# EAGLE design BontempoV2. (EAGLE 9.6.2)
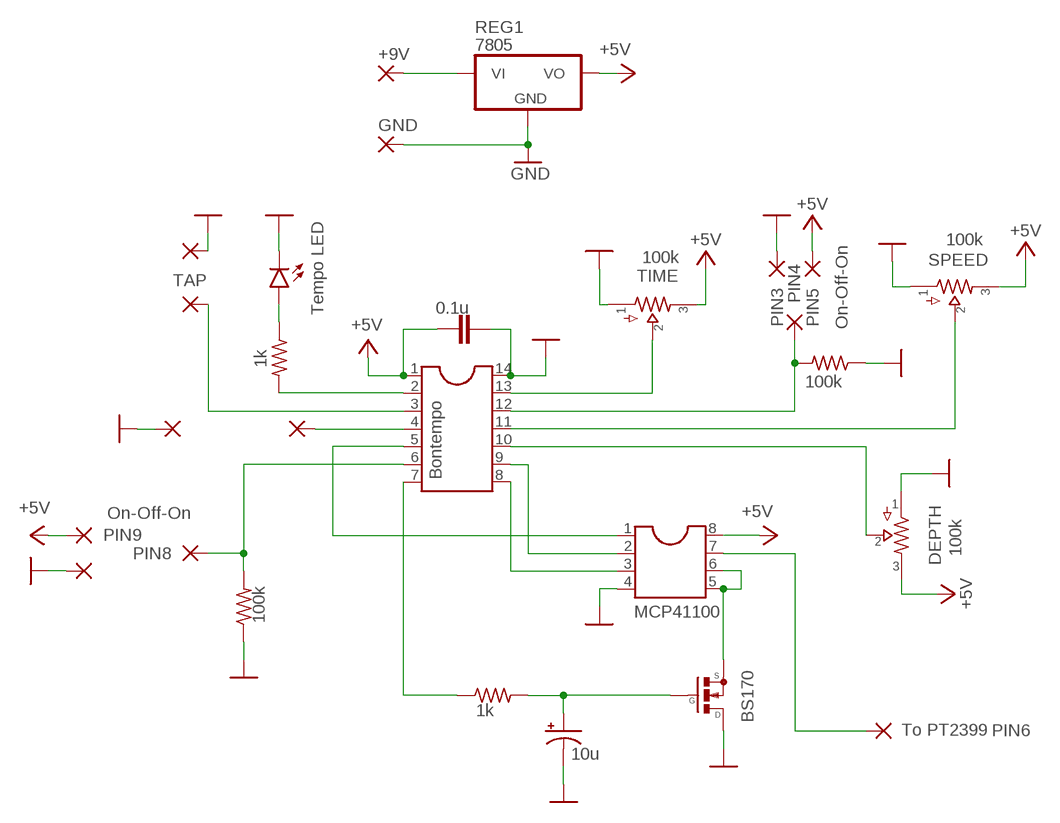
[diagram p0: schematic, sheet 1]

## Parts
+9V  2,54/1,1  [2,54/1,1]
C1  10u  0500  [050_020]
C2  0.1u  CER/FILMBOX.1  [BOX_SMALL]
D1  LED3MM  [LED3MM]
DEPTH  100k  POTSSMALL_PADS  [PADS_SMALL]
GND  2,54/1,1  [2,54/1,1]
IC1  Bontempo  DIL14  [DIL14]
IC2  MCP41100  DIL8  [DIL08]
PIN1  2,54/1,1  [2,54/1,1]
PIN2  2,54/1,1  [2,54/1,1]
PIN3  2,54/1,1  [2,54/1,1]
PIN4  2,54/1,1  [2,54/1,1]
PIN5  2,54/1,1  [2,54/1,1]
PIN6  2,54/1,1  [2,54/1,1]
PIN7  2,54/1,1  [2,54/1,1]
PIN8  2,54/1,1  [2,54/1,1]
PIN9  2,54/1,1  [2,54/1,1]
PIN11  2,54/1,1  [2,54/1,1]
PIN12  2,54/1,1  [2,54/1,1]
Q1  BS170  [SOT54ES]
R1  1k  R_.3B  [R0207/3]
R3  1k  R_.3B  [R0207/3]
R4  100k  R_.3B  [R0207/3]
R5  100k  R_.3B  [R0207/3]
REG1  7805  [TO92-]
SPEED  100k  POTSSMALL_PADS  [PADS_SMALL]
TIME  100k  POTSSMALL_PADS  [PADS_SMALL]

## Nets
+5V: C2.1 DEPTH.3 IC1.1 IC2.8 PIN5.1(P) PIN9.1(P) REG1.3(VO) SPEED.3 TIME.3
GND: C1.- C2.2 D1.K(C) DEPTH.1 GND.1(P) IC1.14 IC2.4 PIN2.1(P) PIN3.1(P) PIN7.1(P) PIN11.1(P) Q1.D R4.1 R5.1 REG1.2(GND) SPEED.1 TIME.1
N$1: IC1.2 R1.2
N$2: IC2.5 IC2.6 Q1.S
N$3: IC1.9 IC2.2
N$4: IC1.8 IC2.3
N$5: D1.A R1.1
N$6: IC1.4 PIN12.1(P)
N$7: IC1.3 PIN1.1(P)
N$8: C1.+ Q1.G R3.2
N$9: IC1.7 R3.1
N$10: IC1.5 IC2.1
N$12: IC1.6 PIN8.1(P) R4.2
N$13: IC1.13 TIME.2
N$14: IC1.11 SPEED.2
N$15: IC1.12 PIN4.1(P) R5.2
N$16: DEPTH.2 IC1.10
N$17: +9V.1(P) REG1.1(VI)
N$18: IC2.7 PIN6.1(P)

## Notes on the sheet
- TAP
- Tempo LED
- On-Off-On
- On-Off-On
- To PT2399

## Library data of the parts
+9V GND PIN1-PIN9 PIN11 PIN12 = wirepad:2,54/1,1: THROUGH-HOLE PAD
C1 = capacitors-elec:050: 0.22 - 100uF Xicon values at Mouser.com: 10V: 10 - 100uF; 16V: 2.2 - 47uF; 25V: 0.47 - 47uF; 50V: 0.22 - 22uF
C2 = capacitors-film:CER/FILM: 47 - 120pF Xicon Ceramic Disc 2.5mm lead spacing
D1 = diodes:LED
DEPTH SPEED TIME = potentiometers:POTS
IC1 = integrated circuits:DIL14
IC2 = integrated circuits:DIL8: Dual In Line
Q1 = transistors:BS170: N-CHANNEL MOS FET
R1 R3-R5 = resistors:R_
REG1 = regulators:7805

## Board
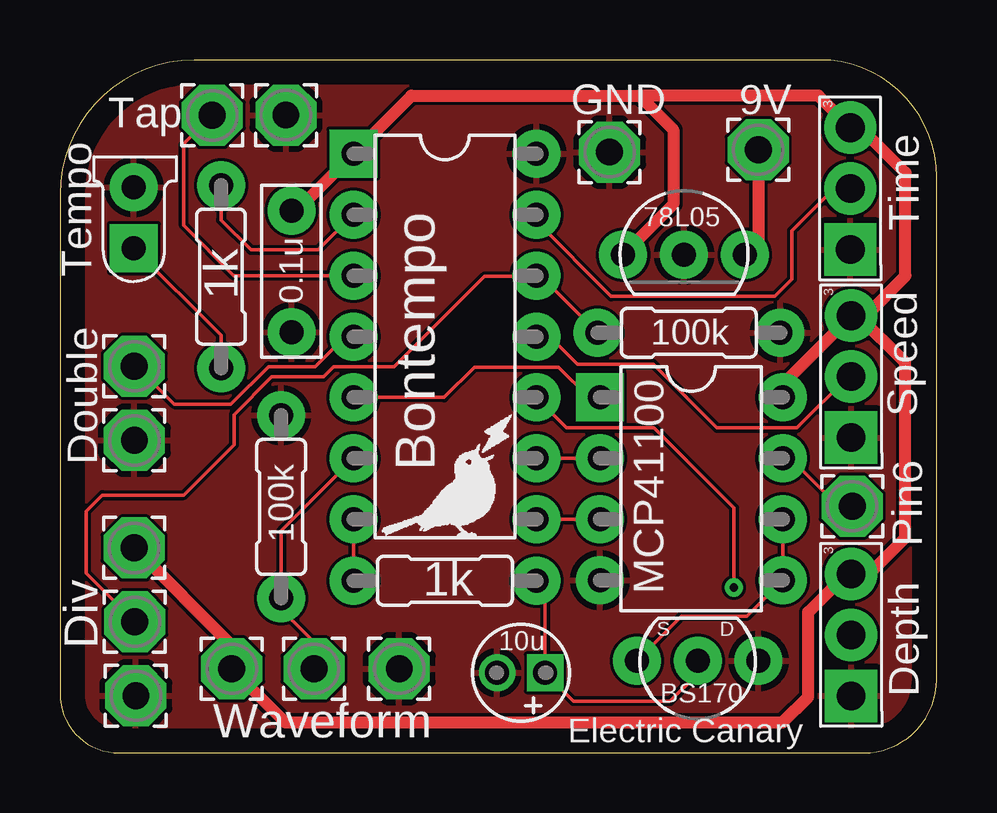
[diagram p1: board, top side]
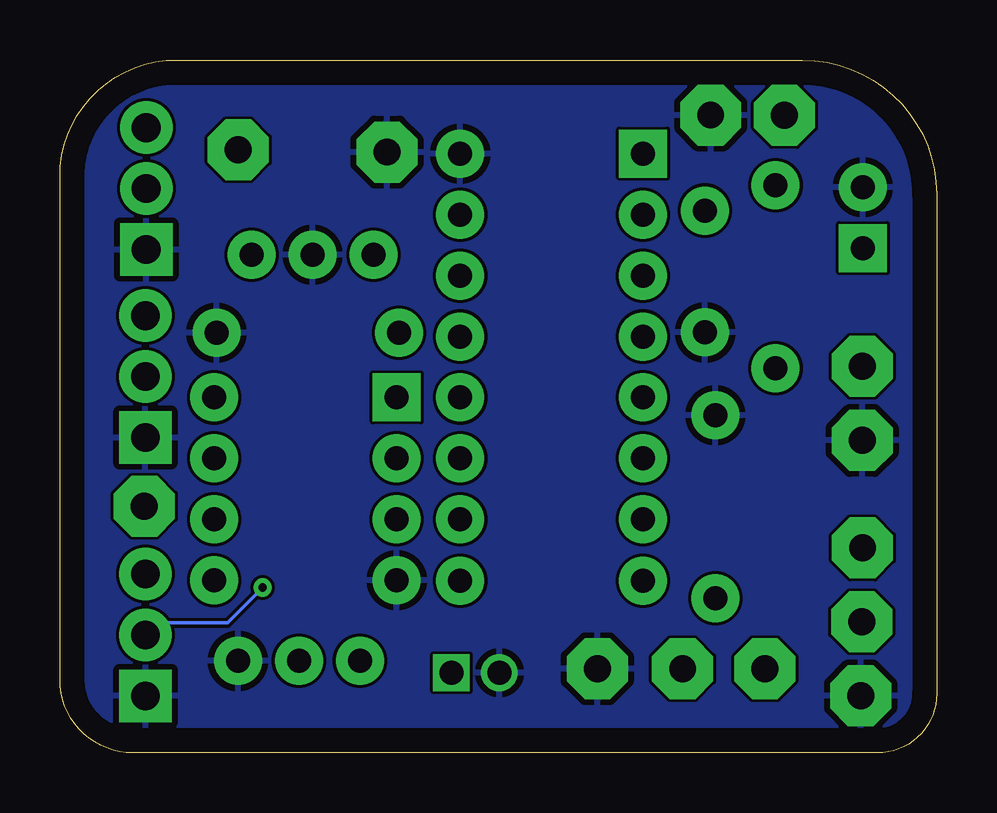
[diagram p2: board, bottom side, seen from below]

Size 36.54 x 28.87 mm. Coordinates in mm from the lower left corner, seen from the top.
Outline: 0,23.28 0,2.46 arc90 2.46,0 33.5,0 arc90 36.54,3.05 36.54,24 arc90 31.68,28.87 5.59,28.87 arc90 0,23.28
Copper layers (1*16): Top 0.035mm / dielectric 1.5mm / Bottom 0.035mm
Design rules "default *": minimum track width 5mil, minimum drill 0.35mm, track to track 5mil, track to pad 6mil, pad to pad 6mil, via to via 6mil, smd to smd 6mil, copper to edge 40mil, drill to drill 21mil, minimum pad ring 10mil, minimum via ring 8mil, stop-mask expansion 4mil, vias tented up to drill 0mil, thermal gap 10mil

### Footprints (pad centres in the part's own frame; a part is rotated, then mirrored left to right if it is on the bottom)
2,54/1,1 = drill 1.118 pad 2.54 octagon: 1 0,0
050_020 = drill 1 pad 1.524 square: + -1,0 | drill 1 pad 1.524: - 1,0
BOX_SMALL = drill 1 pad 2: 1 -2.54,0; 2 2.54,0
LED3MM = drill 1 pad 2 square: A -1.27,0 | drill 1 pad 2: K 1.27,0
PADS_SMALL = drill 1.2 pad 2.184 square: 1 2.54,0 | drill 1.2 pad 2.184: 2 0,0; 3 -2.54,0
DIL14 = drill 1 pad 2 square: 1 -7.62,-3.81 | drill 1 pad 2: 2 -5.08,-3.81; 3 -2.54,-3.81; 4 0,-3.81; 5 2.54,-3.81; 6 5.08,-3.81; 7 7.62,-3.81; 8 7.62,3.81; 9 5.08,3.81; 10 2.54,3.81; 11 0,3.81; 12 -2.54,3.81; 13 -5.08,3.81; 14 -7.62,3.81
DIL08 = drill 1 pad 2 square: 1 -3.81,-3.81 | drill 1 pad 2: 2 -1.27,-3.81; 3 1.27,-3.81; 4 3.81,-3.81; 5 3.81,3.81; 6 1.27,3.81; 7 -1.27,3.81; 8 -3.81,3.81
SOT54ES = drill 1 pad 2: D -2.54,0; G 0,0; S 2.54,0
R0207/3 = drill 1 pad 2: 1 -3.81,0; 2 3.81,0
TO92- = drill 1 pad 2: 1 -2.54,0; 2 0,0; 3 2.54,0

### Placement (x,y rotation side)
+9V  29.11,25.13 0 top
C1  19.22,3.34 180 top
C2  9.65,20.06 270 top
D1  3.07,22.3 90 top
DEPTH  32.98,4.91 270 top
GND  22.91,25.03 0 top
IC1  16.05,17.35 270 top
IC2  26.32,11 270 top
PIN1  6.35,26.57 90 top
PIN2  9.42,26.58 90 top
PIN3  3.17,2.38 0 top
PIN4  3.12,5.46 0 top
PIN5  3.09,8.54 0 top
PIN6  33.03,10.28 0 top
PIN7  14.14,3.51 0 top
PIN8  10.59,3.51 0 top
PIN9  7.16,3.51 0 top
PIN11  3.1,13.02 0 top
PIN12  3.1,16.11 0 top
Q1  26.58,3.83 180 top
R1  6.71,19.84 90 top
R3  16.05,7.17 0 top
R4  9.22,10.25 270 top
R5  26.21,17.51 180 top
REG1  26.02,20.76 180 top
SPEED  32.98,15.68 270 top
TIME  32.95,23.51 270 top

### Tracks (layer width: path | path; a pad name or v marks a point on that pad's centre or on a via)
+5V
  Top 0.508: PIN5.1 7.16,4.47 PIN9.1 9.39,1.27 30.12,1.27 31.19,2.34 31.19,5.87 32.77,7.45 DEPTH.3 33.73,7.45 35.23,8.96 35.23,16.26 33.27,18.22 SPEED.3 | C2.1 9.87,22.6 IC1.1 14.65,27.38 24.15,27.38 | SPEED.3 30.13,15.36 IC2.8 | SPEED.3 33.59,18.22 35.25,19.88 35.25,24.18 33.37,26.05 TIME.3 31.62,27.38 24.15,27.38 | 24.15,27.38 25.57,25.96 25.57,22.85 REG1.3
GND
  pour Bottom: -1.69,36.98 -1.69,-0.81 40.43,-0.81 40.43,33.99 37.44,36.98
  pour Top: 1.75,33 -6.33,24.93 -6.33,-3.41 -4.87,-4.87 39.76,-4.87 42.96,-1.67 42.96,23.54 33.5,33 1.78,33
N$1
  Top 0.152: R1.2 6.71,22.2 7.96,20.95 10.77,20.95 IC1.2
N$2
  Top 0.152: IC2.6 IC2.5 28.63,5.7 25.91,5.7 Q1.S
N$3
  Top 0.152: IC1.9 IC2.2
N$4
  Top 0.152: IC1.8 IC2.3
N$5
  Top 0.152: R1.1 6.71,17.4 D1.A
N$6
  Top 0.152: PIN12.1 3.18,16.11 4.76,14.53 7.12,14.53 8.69,16.1 10.63,16.1 11.88,17.35 IC1.4
N$7
  Top 0.152: IC1.3 7.25,19.89 5.16,21.98 5.16,25.38 PIN1.1
N$8
  Top 0.152: R3.2 20.22,6.81 C1.+ 21.4,2.16 25.44,2.16 26.58,3.31 Q1.G
N$9
  Top 0.152: R3.1 IC1.7
N$10
  Top 0.152: IC2.1 22.04,14.81 20.78,16.07 17.28,16.07 16.01,14.81 IC1.5
N$12
  Top 0.152: IC1.6 9.22,9.25 R4.2 9.22,5.98 10.59,4.62 PIN8.1
N$13
  Top 0.152: TIME.2 32.27,23.51 30.51,21.76 30.51,19.74 29.8,19.02 22.98,19.02 19.86,22.14 IC1.13
N$14
  Top 0.152: IC1.11 20.43,17.35 21.58,16.2 24.73,16.2 27.39,13.54 30.72,13.54 32.86,15.68 SPEED.2
N$15
  Top 0.152: IC1.12 19.94,19.89 19.97,19.86 | R5.2 20.05,19.86 19.97,19.86 | PIN4.1 1.09,7.49 1.09,10.06 1.77,10.74 5.16,10.74 7.26,12.84 7.26,14.1 8.82,15.66 10.98,15.66 11.41,16.08 13.93,16.08 17.7,19.86 19.97,19.86
N$16  (via drill 0.35)
  Top 0.152: IC1.10 21.12,13.54 24.76,13.54 28.1,10.21 v28.1,6.89
  Bottom 0.152: v28.1,6.89 28.1,6.88 29.56,5.41 32.48,5.41 DEPTH.2
N$17
  Top 0.508: +9V.1 29.11,21.31 REG1.1
N$18
  Top 0.152: IC2.7 30.46,12.27 32.45,10.28 PIN6.1

### Text on the board
tPlace: GND | 9V | Tap | 78L05 | Time | Tempo | 1k | 0.1u | 100k | Speed | Double | 100k | Bontempo | Pin6 | 1k | MCP41100 | Div | 10u | BS170 | Depth | Waveform
tNames: Electric Canary